# EAGLE design Trimble Thunderbolt Monitor Shield v1 (EAGLE 6.4)
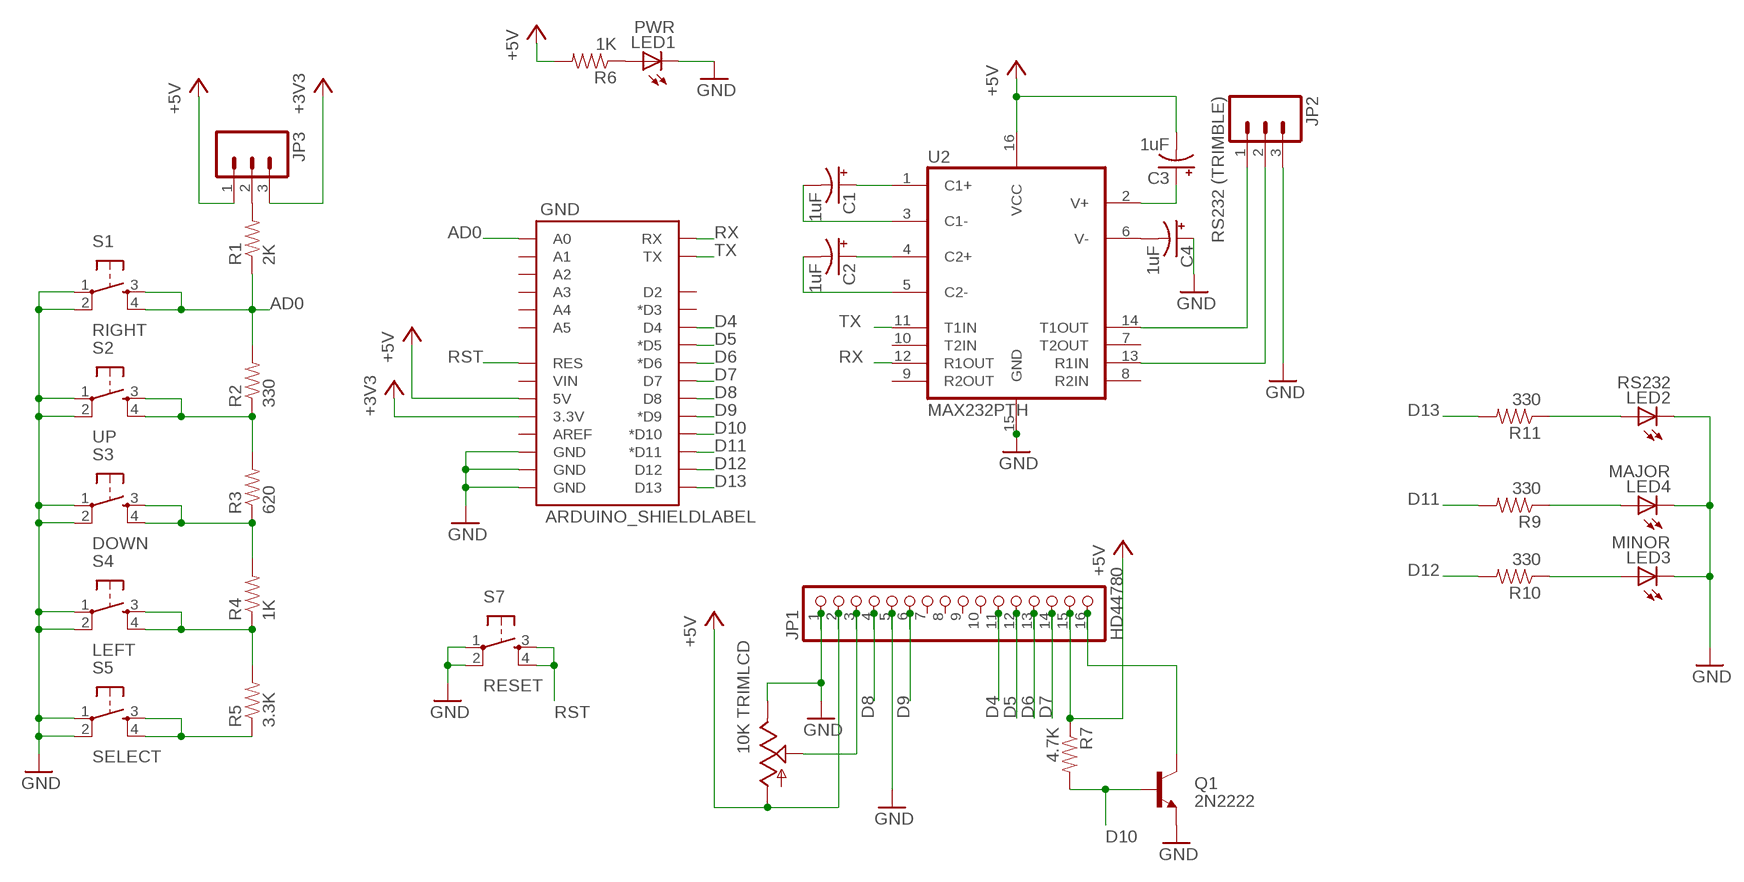
[diagram p0: schematic, sheet 1]

## Parts
C1  1uF  CAP_POLPTH2  [CPOL-RADIAL-10UF-25V]
C2  1uF  CAP_POLPTH2  [CPOL-RADIAL-10UF-25V]
C3  1uF  CAP_POLPTH2  [CPOL-RADIAL-10UF-25V]
C4  1uF  CAP_POLPTH2  [CPOL-RADIAL-10UF-25V]
GND  ARDUINO_SHIELDLABEL  [DUEMILANOVE_SHIELD]
JP1  HD44780  PINHD-1X16  [1X16]
JP2  RS232 (TRIMBLE)  M03POLAR  [MOLEX-1X3]
JP3  M03PTH  [1X03]
LED1  PWR  LED5MM  [LED5MM]
LED2  RS232  LED5MM  [LED5MM]
LED3  MINOR  LED5MM  [LED5MM]
LED4  MAJOR  LED5MM  [LED5MM]
Q1  2N2222  TRANSISTOR_NPNTO-92-AMMO  [TO-92-AMMO]
R1  2K  RESISTORAXIAL-0.3  [AXIAL-0.3]
R2  330  RESISTORAXIAL-0.3  [AXIAL-0.3]
R3  620  RESISTORAXIAL-0.3  [AXIAL-0.3]
R4  1K  RESISTORAXIAL-0.3  [AXIAL-0.3]
R5  3.3K  RESISTORAXIAL-0.3  [AXIAL-0.3]
R6  1K  RESISTORAXIAL-0.3  [AXIAL-0.3]
R7  4.7K  RESISTORAXIAL-0.3  [AXIAL-0.3]
R9  330  RESISTORAXIAL-0.3  [AXIAL-0.3]
R10  330  RESISTORAXIAL-0.3  [AXIAL-0.3]
R11  330  RESISTORAXIAL-0.3  [AXIAL-0.3]
S1  RIGHT  TAC_SWITCHPTH  [TACTILE-PTH]
S2  UP  TAC_SWITCHPTH  [TACTILE-PTH]
S3  DOWN  TAC_SWITCHPTH  [TACTILE-PTH]
S4  LEFT  TAC_SWITCHPTH  [TACTILE-PTH]
S5  SELECT  TAC_SWITCHPTH  [TACTILE-PTH]
S7  RESET  TAC_SWITCHPTH  [TACTILE-PTH]
TRIMLCD  10K  POT100K_3362U  [3362U]
U2  MAX232PTH  [DIL16]

## Nets
+3V3: GND.3.3V JP3.3
+5V: C3.2(-) GND.5V JP1.2 JP1.15 JP3.1 R6.P$2 R7.P$1 TRIMLCD.P$3(A) U2.16(VCC)
AD0: GND.A0 R1.P$1 R2.P$2 S1.3 S1.4
D4: GND.D4 JP1.11
D5: GND.D5(*D5) JP1.12
D6: GND.D6(*D6) JP1.13
D7: GND.D7 JP1.14
D8: GND.D8 JP1.4
D9: GND.D9(*D9) JP1.6
D10: GND.D10(*D10) Q1.2(B) R7.P$2
D11: GND.D11(*D11) R9.P$2
D12: GND.D12 R10.P$2
D13: GND.D13 R11.P$2
GND: C4.1(+) GND.GND@0(GND) GND.GND@1(GND) GND.GND@2(GND) JP1.1 JP1.5 JP2.3 LED1.K(C) LED2.K(C) LED3.K(C) LED4.K(C) Q1.1(E) S1.1 S1.2 S2.1 S2.2 S3.1 S3.2 S4.1 S4.2 S5.1 S5.2 S7.1 S7.2 TRIMLCD.P$1(E) U2.15(GND)
LEDRS232: LED2.A R11.P$1
N$1: R3.P$1 R4.P$2 S3.3 S3.4
N$2: LED4.A R9.P$1
N$3: R4.P$1 R5.P$2 S4.3 S4.4
N$4: LED1.A R6.P$1
N$5: R5.P$1 S5.3 S5.4
N$6: JP2.1 U2.14(T1OUT)
N$7: JP1.16 Q1.3(C)
N$8: JP1.3 TRIMLCD.P$2(S)
N$9: JP2.2 U2.13(R1IN)
N$10: C1.2(-) U2.3(C1-)
N$13: C1.1(+) U2.1(C1+)
N$14: C2.1(+) U2.4(C2+)
N$15: C2.2(-) U2.5(C2-)
N$16: C4.2(-) U2.6(V-)
N$17: C3.1(+) U2.2(V+)
N$18: LED3.A R10.P$1
N$19: JP3.2 R1.P$2
N$20: R2.P$1 R3.P$2 S2.3 S2.4
RST: GND.RES S7.3 S7.4
RX: GND.RX U2.12(R1OUT)
TX: GND.TX U2.11(T1IN)
Unconnected: GND.A1 GND.A2 GND.A3 GND.A4 GND.A5 GND.AREF GND.D2 GND.D3(*D3) GND.VIN JP1.7 JP1.8 JP1.9 JP1.10 U2.7(T2OUT) U2.8(R2IN) U2.9(R2OUT) U2.10(T2IN)

## Library data of the parts
C1-C4 = SparkFun:CAP_POL: Capacitor Polarized These are standard SMD and PTH capacitors. Normally 10uF, 47uF, and 100uF in electrolytic and tantalum varieties. Always verify the external diameter of the through hole cap, it varies with capacity, voltage, and manufacturer. The EIA devices should be standard.
GND = SparkFun:ARDUINO_SHIELD
JP1 = pinhead:PINHD-1X16: PIN HEADER
JP2 JP3 = SparkFun:M03: Header 3 Standard 3-pin 0.1" header. Use with straight break away headers (SKU : PRT-00116), right angle break away headers (PRT-00553), swiss pins (PRT-00743), machine pins (PRT-00117), and female headers (PRT-00115). Molex polarized connector foot print use with SKU : PRT-08232 with associated crimp pins and housings.
LED1-LED4 = led:LED: LED OSRAM: - CHIPLED LG R971, LG N971, LY N971, LG Q971, LY Q971, LO R971, LY R971 LH N974, LH R974 LS Q976, LO Q976, LY Q976 LO Q996 - Hyper CHIPLED LW Q18S LB Q993, LB Q99A, LB R99A - SideLED LS A670, LO A670, LY A670, LG A670, LP A670 LB A673, LV A673, LT A673, LW A673 LH A674 LY A675 LS A676, LA A676, LO A676, LY A676, LW A676 LS A679, LY A679, LG A679 - Hyper Micro SIDELED® LS Y876, LA Y876, LO Y876, LY Y876 LT Y87S - SmartLED LW L88C, LW L88S LB L89C, LB L89S, LG L890 LS L89K, LO L89K, LY L89K LS L896, LA L896, LO L896, LY L896 - TOPLED LS T670, LO T670, LY T670, LG T670, LP T670 LSG T670, LSP T670, LSY T670, LOP T670, LYG T670 LG T671, LOG T671, LSG T671 LB T673, LV T673, LT T673, LW T673 LH T674 LS T676, LA T676, LO T676, LY T676, LB T676, LH T676, LSB T676, LW T676 LB T67C, LV T67C, LT T67C, LS T67K, LO T67K, LY T67K, LW E67C LS E67B, LA E67B, LO E67B, LY E67B, LB E67C, LV E67C, LT E67C LW T67C LS T679, LY T679, LG T679 LS T770, LO T770, LY T770, LG T770, LP T770 LB T773, LV T773, LT T773, LW T773 LH T774 LS E675, LA E675, LY E675, LS T675 LS T776, LA T776, LO T776, LY T776, LB T776 LHGB T686 LT T68C, LB T68C - Hyper Mini TOPLED® LB M676 - Mini TOPLED Santana® LG M470 LS M47K, LO M47K, LY M47K Source: http://www.osram.convergy.de LUXEON: - LUMILED® LXK2-PW12-R00, LXK2-PW12-S00, LXK2-PW14-U00, LXK2-PW14-V00 LXK2-PM12-R00, LXK2-PM12-S00, LXK2-PM14-U00 LXK2-PE12-Q00, LXK2-PE12-R00, LXK2-PE12-S00, LXK2-PE14-T00, LXK2-PE14-U00 LXK2-PB12-K00, LXK2-PB12-L00, LXK2-PB12-M00, LXK2-PB14-N00, LXK2-PB14-P00, LXK2-PB14-Q00 LXK2-PR12-L00, LXK2-PR12-M00, LXK2-PR14-Q00, LXK2-PR14-R00 LXK2-PD12-Q00, LXK2-PD12-R00, LXK2-PD12-S00 LXK2-PH12-R00, LXK2-PH12-S00 LXK2-PL12-P00, LXK2-PL12-Q00, LXK2-PL12-R00 Source: www.luxeon.com KINGBRIGHT: KA-3528ASYC Source: www.kingbright.com
Q1 = SparkFun:TRANSISTOR_NPN: Transistor NPN BJT configuration in SOT23 package. MMBT2222 is the common NPN we use. Double check BCE configuration again layout.
R1-R7 R9-R11 = SparkFun:RESISTOR: Resistor Basic schematic elements and footprints for 0603, 1206, and PTH resistors.
S1-S5 S7 = SparkFun:TAC_SWITCH: Momentary Switch Button commonly used for reset or general input. Spark Fun Electronics SKU : COM-00097
TRIMLCD = SparkFun:POT
U2 = SparkFun:MAX232: RS232 Transceiver Very common IC. This is generically called 'MAX232', but works with the 3V equivalent MAX3232 generic ICs. Field tested and mother approved. Spark Fun Electronics SKU : COM-00316 (DIP) and COM-00589 (SMD)

## Board
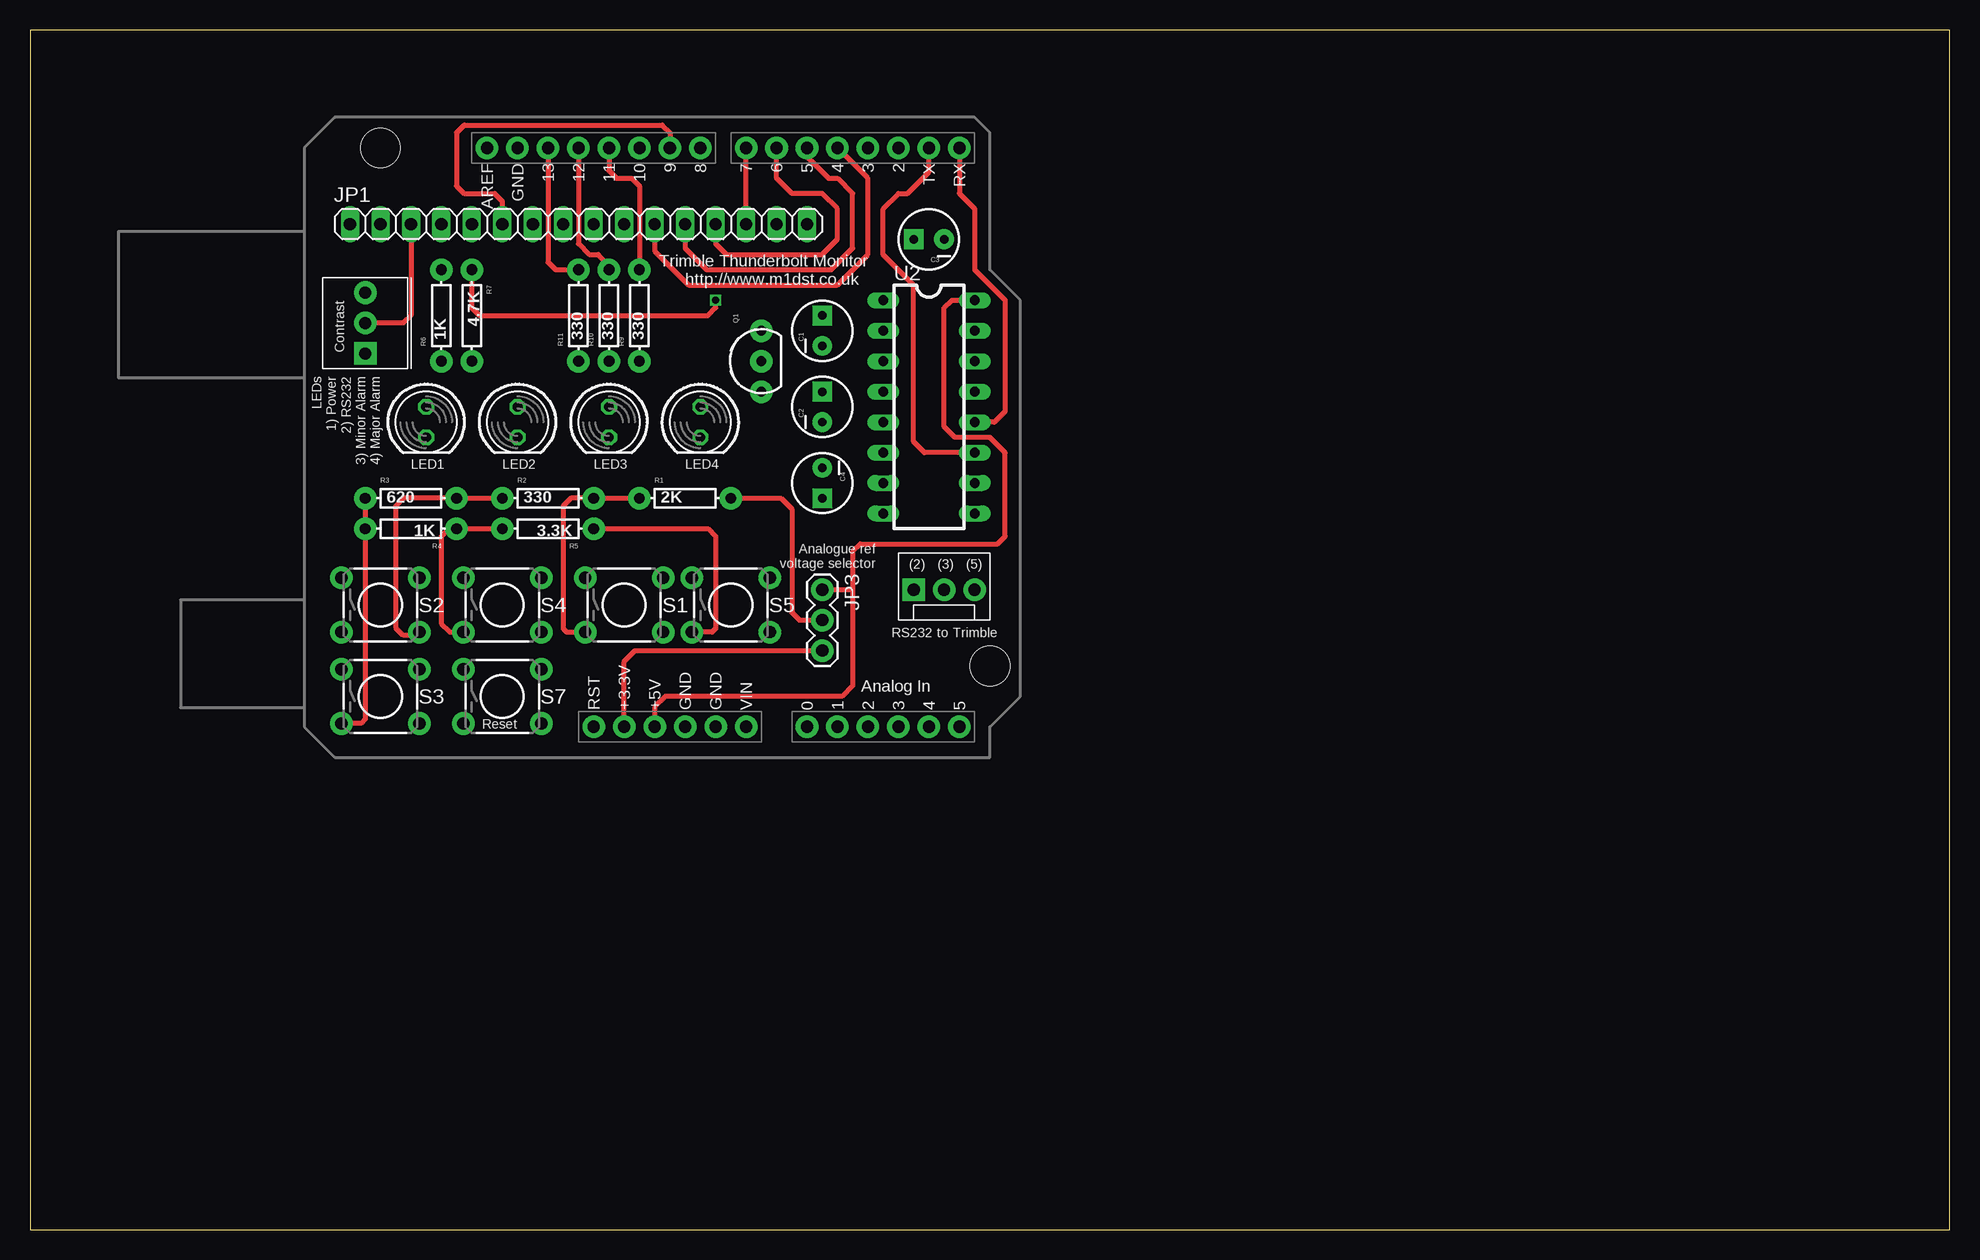
[diagram p1: board, top side]
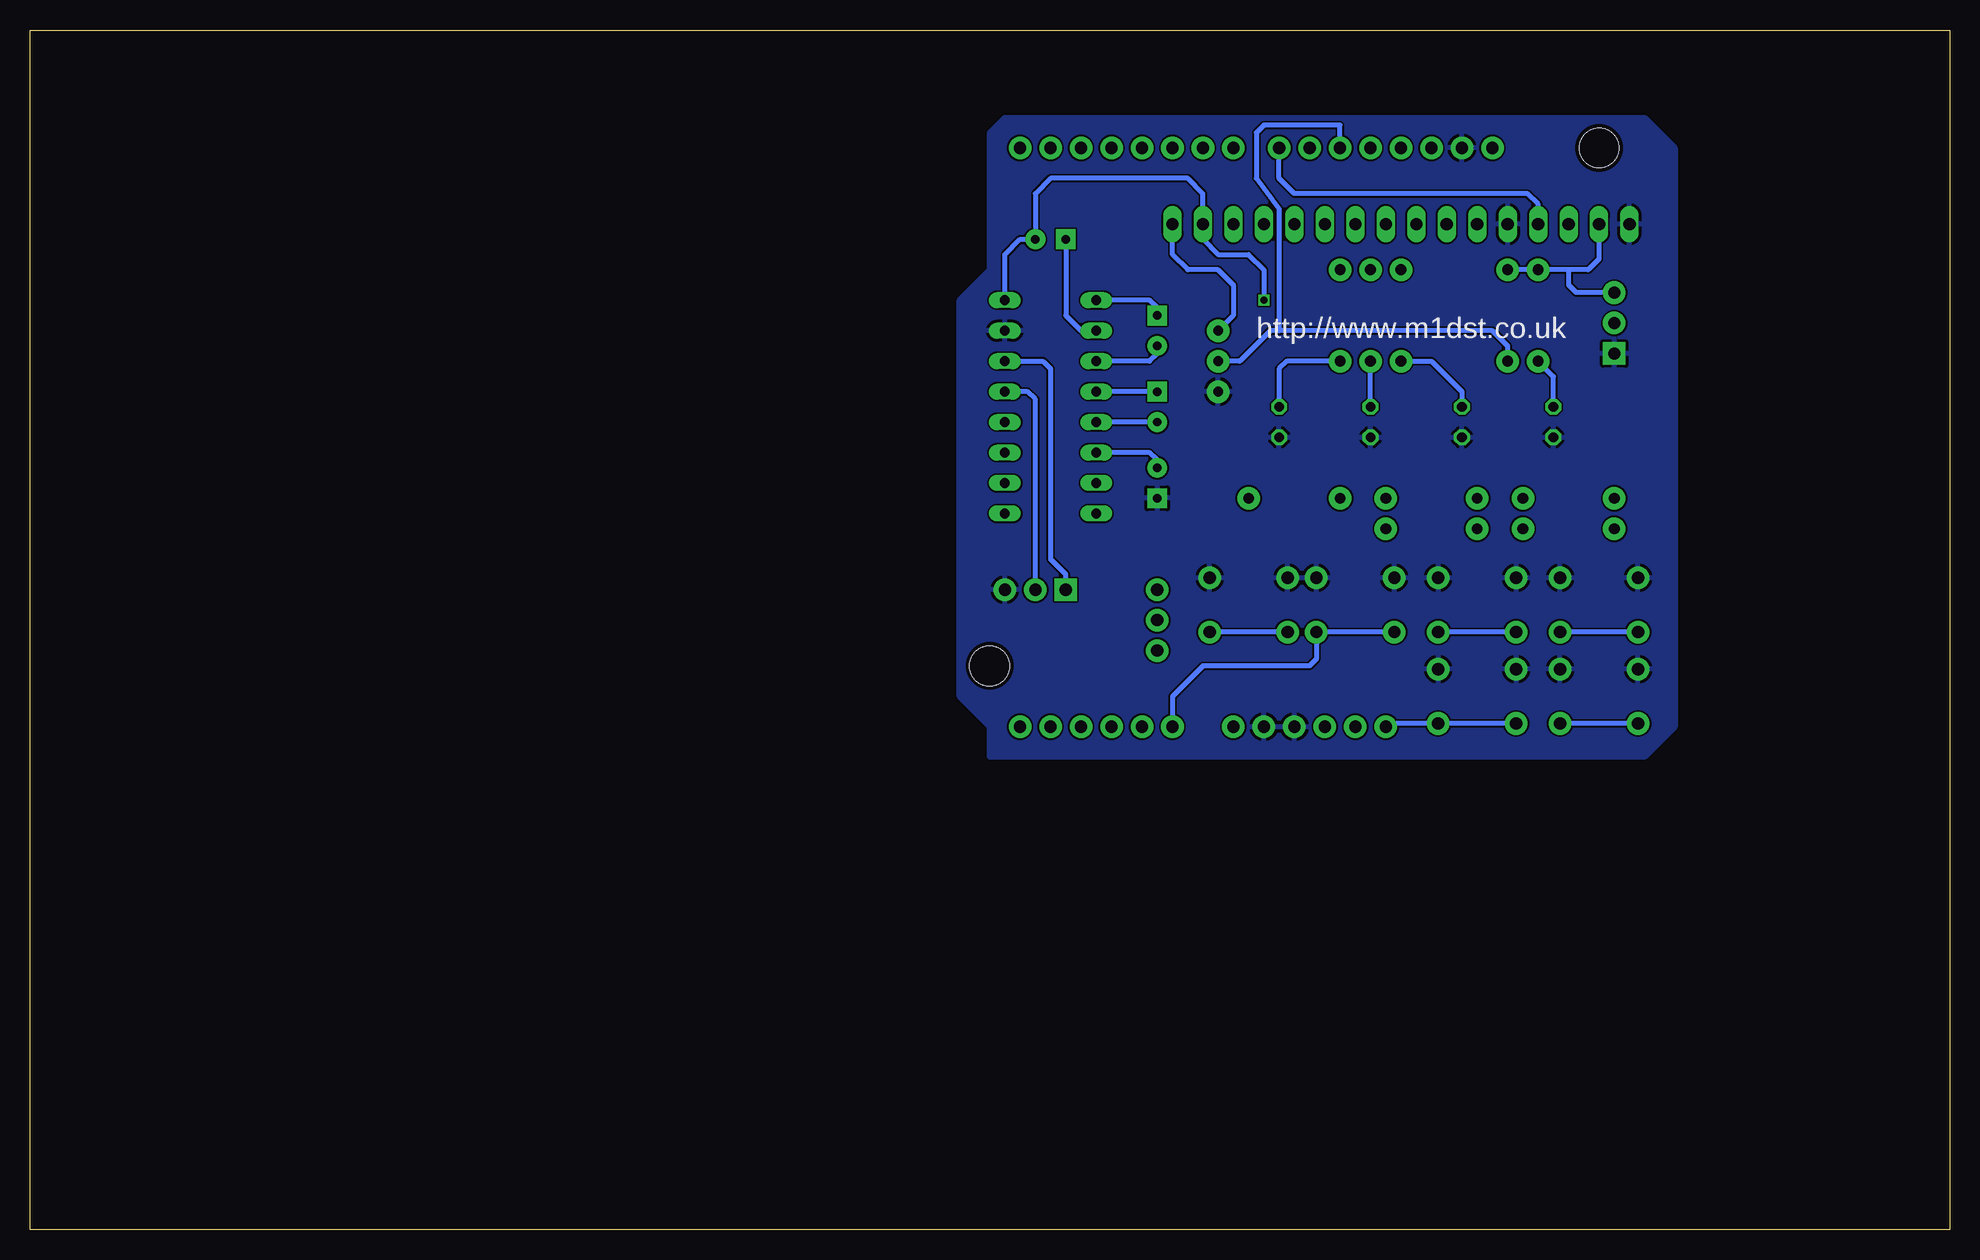
[diagram p2: board, bottom side, seen from below]

Size 160 x 100 mm. Coordinates in mm from the lower left corner, seen from the top.
Outline: 0,0 160,0 160,100 0,100 0,0
Copper layers (1*16): Top 0.035mm / dielectric 1.5mm / Bottom 0.035mm
Design rules "ITead_rule": minimum track width 6mil, minimum drill 12mil, track to track 6mil, track to pad 6mil, pad to pad 6mil, via to via 6mil, smd to smd 0mil, copper to edge 10mil, drill to drill 10mil, minimum pad ring 10mil, minimum via ring 6mil, stop-mask expansion 2mil, vias tented up to drill 100mil, thermal gap 10mil

### Footprints (pad centres in the part's own frame; a part is rotated, then mirrored left to right if it is on the bottom)
CPOL-RADIAL-10UF-25V = drill 0.7 pad 1.651 square: 1 1.27,0 | drill 0.7 pad 1.651: 2 -1.27,0
DUEMILANOVE_SHIELD = drill 1.016 pad 1.88: 3.3V 50.8,26.67; 5V 50.8,29.21; A0 50.8,41.91; A1 50.8,44.45; A2 50.8,46.99; A3 50.8,49.53; A4 50.8,52.07; A5 50.8,54.61; AREF 2.54,15.24; D2 2.54,49.53; D3 2.54,46.99; D4 2.54,44.45; D5 2.54,41.91; D6 2.54,39.37; D7 2.54,36.83; D8 2.54,33.02; D9 2.54,30.48; D10 2.54,27.94; D11 2.54,25.4; D12 2.54,22.86; D13 2.54,20.32; GND@0 50.8,31.75; GND@1 50.8,34.29; GND@2 2.54,17.78; RES 50.8,24.13; RX 2.54,54.61; TX 2.54,52.07; VIN 50.8,36.83 | hole 3.302: 45.72,57.15; 2.54,6.35
1X16 = drill 1.016 long: 1 -19.05,0; 2 -16.51,0; 3 -13.97,0; 4 -11.43,0; 5 -8.89,0; 6 -6.35,0; 7 -3.81,0; 8 -1.27,0; 9 1.27,0; 10 3.81,0; 11 6.35,0; 12 8.89,0; 13 11.43,0; 14 13.97,0; 15 16.51,0; 16 19.05,0
MOLEX-1X3 = drill 1.016 pad 1.88 square: 1 0,0 | drill 1.016 pad 1.88: 2 2.54,0; 3 5.08,0
1X03 = drill 1.016 pad 1.88: 1 0,0; 2 2.54,0; 3 5.08,0
LED5MM = drill 0.813 octagon: A -1.27,0; K 1.27,0
TO-92-AMMO = drill 0.813 pad 1.88: 1 -2.54,0; 2 0,0; 3 2.54,0
AXIAL-0.3 = drill 0.9 pad 1.88: P$1 -3.81,0; P$2 3.81,0
TACTILE-PTH = drill 1.016 pad 1.88: 1 -3.251,2.261; 2 3.251,2.261; 3 -3.251,-2.261; 4 3.251,-2.261
3362U = drill 1.016 pad 1.88 square: P$1 0,2.54 | drill 1.016 pad 1.88: P$2 2.54,2.54; P$3 5.08,2.54
DIL16 = drill 0.813 long: 1 -8.89,-3.81; 2 -6.35,-3.81; 3 -3.81,-3.81; 4 -1.27,-3.81; 5 1.27,-3.81; 6 3.81,-3.81; 7 6.35,-3.81; 8 8.89,-3.81; 9 8.89,3.81; 10 6.35,3.81; 11 3.81,3.81; 12 1.27,3.81; 13 -1.27,3.81; 14 -3.81,3.81; 15 -6.35,3.81; 16 -8.89,3.81

### Placement (x,y rotation side)
C1  66.04,74.93 90 top
C2  66.04,68.58 90 top
C3  74.93,82.55 180 top
C4  66.04,62.23 270 top
GND  22.86,92.71 270 top
JP1  45.72,83.82 0 top
JP2  73.66,53.34 0 top
JP3  66.04,53.34 270 top
LED1  33.02,67.31 270 top
LED2  40.64,67.31 270 top
LED3  48.26,67.31 270 top
LED4  55.88,67.31 270 top
Q1  60.96,72.39 90 top
R1  54.61,60.96 0 top
R2  43.18,60.96 0 top
R3  31.75,60.96 0 top
R4  31.75,58.42 180 top
R5  43.18,58.42 180 top
R6  34.29,76.2 90 top
R7  36.83,76.2 270 top
R9  50.8,76.2 90 top
R10  48.26,76.2 90 top
R11  45.72,76.2 90 top
S1  49.53,52.07 0 top
S2  29.21,52.07 0 top
S3  29.21,44.45 0 top
S4  39.37,52.07 0 top
S5  58.42,52.07 0 top
S7  39.37,44.45 0 top
TRIMLCD  30.48,73.03 90 top
U2  74.93,68.58 270 top

### Tracks (layer width: path | path; a pad name or v marks a point on that pad's centre or on a via)
+3V3
  Top 0.406: GND.3.3V 49.53,47.36 50.43,48.26 JP3.3
+5V  (via drill 0.6)
  Top 0.406: 68.58,53.34 68.58,56.52 69.22,57.15 80.64,57.15 81.28,57.78 81.28,64.77 80.01,66.04 77.1,66.04 76.2,66.94 76.2,76.83 76.83,77.47 U2.16 | 68.58,53.34 68.58,45.35 67.68,44.45 52.97,44.45 52.07,43.55 GND.5V | v57.15,77.47 57.15,76.83 56.52,76.2 37.47,76.2 36.83,76.83 R7.P$1 | JP3.1 68.58,53.34
  Bottom 0.406: 31.75,80.01 R6.P$2 R7.P$1 | v57.15,77.47 57.15,80.01 58.42,81.28 60.96,81.28 62.23,82.55 JP1.15 62.23,86.36 63.5,87.63 74.93,87.63 76.2,86.36 C3.2 77.47,82.55 78.74,81.28 U2.16 | TRIMLCD.P$3 31.11,78.11 31.75,78.74 31.75,80.01 | JP1.2 29.21,80.91 30.11,80.01 31.75,80.01
AD0
  Top 0.406: R1.P$1 R2.P$2 45.09,60.96 44.45,60.33 44.45,50.09 44.73,49.81 S1.3
  Bottom 0.406: GND.A0 64.77,44.45 62.23,46.99 53.34,46.99 52.78,47.55 S1.4 S1.3
D4
  Top 0.406: JP1.11 52.07,81.58 54.91,78.74 67.31,78.74 69.85,81.28 69.85,87.63 GND.D4
D5
  Top 0.406: JP1.12 54.61,81.81 56.41,80.01 66.78,80.01 68.58,81.81 68.58,86.36 67.31,87.63 66.57,87.63 64.77,89.43 GND.D5
D6
  Top 0.406: JP1.13 57.15,82.18 58.05,81.28 66.04,81.28 67.31,82.55 67.31,85.09 66.04,86.36 63.5,86.36 62.23,87.63 GND.D6
D7
  Top 0.406: JP1.14 GND.D7
D8
  Bottom 0.406: JP1.4 34.29,85.46 35.19,86.36 54.61,86.36 55.88,87.63 GND.D8
D9
  Top 0.406: JP1.6 39.37,85.72 38.73,86.36 36.2,86.36 35.56,87 35.56,91.44 36.2,92.08 52.7,92.08 53.34,91.44 GND.D9
D10
  Bottom 0.406: R7.P$2 36.83,73.66 38.1,74.93 55.88,74.93 | 55.88,74.93 56.62,74.93 59.16,72.39 Q1.2 | GND.D10 50.8,92.08 57.15,92.08 57.78,91.44 57.78,87.63 55.88,85.09 55.88,74.93
D11
  Top 0.406: GND.D11 48.26,88.27 48.9,87.63 50.16,87.63 50.8,87 R9.P$2
D12
  Top 0.406: GND.D12 45.72,82.18 46.62,81.28 47.36,81.28 48.26,80.38 R10.P$2
D13
  Top 0.406: GND.D13 43.18,80.64 43.81,80.01 R11.P$2
GND
  pour Bottom: 25.4,92.71 22.86,90.17 22.86,41.91 25.4,39.37 80.01,39.37 80.01,41.91 82.55,44.45 82.55,77.47 80.01,80.01 80.01,91.44 78.74,92.71
LEDRS232
  Bottom 0.406: R11.P$1 43.18,72.39 40.64,69.85 LED2.A
N$1
  Top 0.406: R3.P$1 R4.P$2 27.94,42.55 27.58,42.19 S3.3
  Bottom 0.406: S3.3 S3.4
N$2
  Bottom 0.406: R9.P$1 55.24,72.39 55.88,71.75 LED4.A
N$3
  Top 0.406: R5.P$2 R4.P$1 34.92,58.42 34.29,57.78 34.29,50.54 35.02,49.81 S4.3
  Bottom 0.406: S4.3 S4.4
N$4
  Bottom 0.406: LED1.A 33.02,71.12 R6.P$1
N$5
  Top 0.406: R5.P$1 56.52,58.42 57.15,57.78 57.15,50.09 56.87,49.81 S5.3
  Bottom 0.406: S5.3 S5.4
N$6
  Bottom 0.406: U2.14 75.56,72.39 74.93,71.75 74.93,55.88 73.66,54.61 JP2.1
N$7
  Bottom 0.406: JP1.16 64.77,81.28 63.5,80.01 60.96,80.01 59.69,78.74 59.69,76.2 Q1.3
N$8
  Top 0.406: JP1.3 31.75,76.2 31.11,75.56 TRIMLCD.P$2
N$9
  Bottom 0.406: JP2.2 76.2,69.22 76.83,69.85 U2.13
N$10
  Bottom 0.406: C1.2 66.04,73.03 66.67,72.39 U2.3
N$13
  Bottom 0.406: C1.1 66.04,76.83 66.67,77.47 U2.1
N$14
  Bottom 0.406: C2.1 U2.4
N$15
  Bottom 0.406: C2.2 U2.5
N$16
  Bottom 0.406: C4.2 66.04,64.14 66.67,64.77 U2.6
N$17
  Bottom 0.406: U2.2 72.39,74.93 73.66,76.2 C3.1
N$18
  Bottom 0.406: LED3.A R10.P$1
N$19
  Top 0.406: R1.P$2 62.6,60.96 63.5,60.06 63.5,51.44 64.14,50.8 JP3.2
N$20
  Top 0.406: R2.P$1 R3.P$2 31.11,60.96 30.48,60.33 30.48,50.16 31.11,49.53 32.46,49.53 S2.4
  Bottom 0.406: S2.3 S2.4
RST
  Bottom 0.406: S7.3 S7.4 46.71,42.19 GND.RES
RX
  Top 0.406: GND.RX 77.47,86.36 78.74,85.09 78.74,80.01 81.28,77.47 81.28,68.21 80.38,67.31 U2.12
TX
  Top 0.406: U2.11 74.56,64.77 73.66,65.67 73.66,78.74 71.12,81.28 71.12,85.09 72.39,86.36 73.13,86.36 74.93,88.16 GND.TX

### Text on the board
tPlace: Trimble Thunderbolt Monitor | http://www.m1dst.co.uk | Contrast | LEDs / 1) Power / 2) RS232 / 3) Minor Alarm / 4) Major Alarm | Analogue ref / voltage selector | (2) (3) (5) | RS232 to Trimble | Reset
bPlace: http://www.m1dst.co.uk